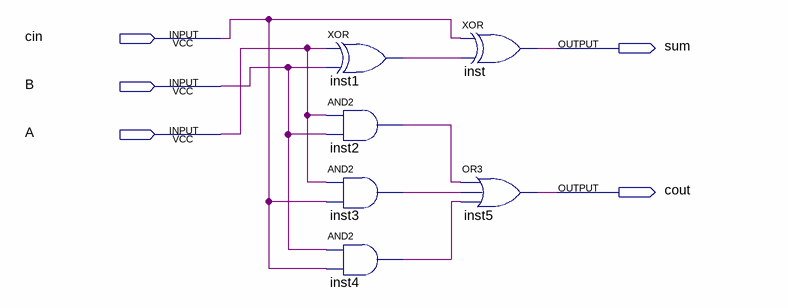
[diagram p0: schematic sheet]
// Quartus schematic fulladder.bdf as structural Verilog: 6 symbols, 5 pins
module fulladder (
  input  cin,
  input  B,
  input  A,
  output sum,
  output cout
);

  wire inst1_out, inst2_out, inst3_out, inst4_out;

  xor inst1 (inst1_out, A, B);
  and inst2 (inst2_out, A, B);
  and inst3 (inst3_out, A, cin);
  and inst4 (inst4_out, B, cin);
  xor inst (sum, cin, inst1_out);
  or inst5 (cout, inst2_out, inst3_out, inst4_out);
endmodule
